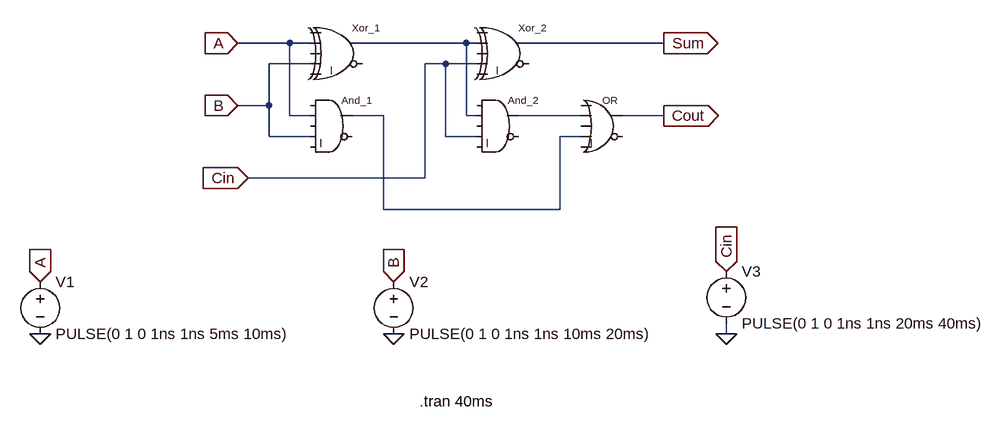
[diagram p0: schematic P1_Full_adder.asc]
P1_Full_adder.asc, the LTspice schematic file:
Version 4
SHEET 1 1264 680
WIRE 160 16 80 16
WIRE 192 16 160 16
WIRE 432 16 256 16
WIRE 448 16 432 16
WIRE 736 16 512 16
WIRE 192 48 128 48
WIRE 400 48 368 48
WIRE 448 48 400 48
WIRE 128 112 128 48
WIRE 128 112 80 112
WIRE 160 128 160 16
WIRE 192 128 160 128
WIRE 304 128 256 128
WIRE 432 128 432 16
WIRE 448 128 432 128
WIRE 608 128 512 128
WIRE 736 128 672 128
WIRE 128 160 128 112
WIRE 192 160 128 160
WIRE 400 160 400 48
WIRE 448 160 400 160
WIRE 608 160 576 160
WIRE 368 224 368 48
WIRE 368 224 96 224
WIRE 304 272 304 128
WIRE 576 272 576 160
WIRE 576 272 304 272
WIRE 832 464 832 448
FLAG 80 16 A
IOPIN 80 16 In
FLAG 80 112 B
IOPIN 80 112 In
FLAG 96 224 Cin
IOPIN 96 224 In
FLAG 736 16 Sum
IOPIN 736 16 Out
FLAG 736 128 Cout
IOPIN 736 128 Out
FLAG -224 464 0
FLAG 320 464 0
FLAG 832 464 0
FLAG -224 384 A
IOPIN -224 384 In
FLAG 320 384 B
IOPIN 320 384 In
FLAG 832 368 Cin
IOPIN 832 368 In
SYMBOL Digital\\xor 240 -32 R0
WINDOW 0 16 24 Left 1
SYMATTR InstName Xor_1
SYMBOL Digital\\xor 496 -32 R0
WINDOW 0 16 24 Left 1
SYMATTR InstName Xor_2
SYMBOL Digital\\and 224 80 R0
WINDOW 0 16 24 Left 1
SYMATTR InstName And_1
SYMBOL Digital\\and 480 80 R0
WINDOW 0 16 24 Left 1
SYMATTR InstName And_2
SYMBOL Digital\\or 640 80 R0
WINDOW 0 1 24 Left 1
SYMATTR InstName OR
SYMBOL voltage -224 368 R0
WINDOW 123 0 0 Left 0
WINDOW 39 0 0 Left 0
SYMATTR InstName V1
SYMATTR Value PULSE(0 1 0 1ns 1ns 5ms 10ms)
SYMBOL voltage 320 368 R0
WINDOW 123 0 0 Left 0
WINDOW 39 0 0 Left 0
SYMATTR InstName V2
SYMATTR Value PULSE(0 1 0 1ns 1ns 10ms 20ms)
SYMBOL voltage 832 352 R0
WINDOW 123 0 0 Left 0
WINDOW 39 0 0 Left 0
SYMATTR InstName V3
SYMATTR Value PULSE(0 1 0 1ns 1ns 20ms 40ms)
TEXT 360 568 Left 2 !.tran 40ms

The netlist it stands for:
* P1_Full_adder.asc
A§Xor_1 0 A 0 B 0 0 N001 0 XOR
A§Xor_2 0 N001 0 Cin 0 0 Sum 0 XOR
And_1 0 A 0 B 0 0 N002 0 AND
And_2 0 N001 0 Cin 0 0 N003 0 AND
A§OR 0 N003 0 N002 0 0 Cout 0 OR
V1 A 0 PULSE(0 1 0 1ns 1ns 5ms 10ms)
V2 B 0 PULSE(0 1 0 1ns 1ns 10ms 20ms)
V3 Cin 0 PULSE(0 1 0 1ns 1ns 20ms 40ms)
.tran 40ms
.backanno
.end